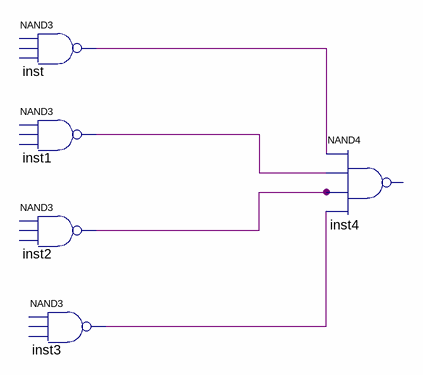
[diagram p0: schematic sheet]
// Quartus schematic lab3.bdf as structural Verilog: 5 symbols, 0 pins
module lab3 (
);

  wire inst1_out, inst2_out, inst3_out, inst_out;

  // NAND3 inst has open pins: IN1=open, IN2=open, IN3=open, OUT=inst_out
  // NAND3 inst1 has open pins: IN1=open, IN2=open, IN3=open, OUT=inst1_out
  // NAND3 inst2 has open pins: IN1=open, IN2=open, IN3=open, OUT=inst2_out
  // NAND3 inst3 has open pins: IN1=open, IN2=open, IN3=open, OUT=inst3_out
  // NAND4 inst4 has open pins: IN1=inst_out, IN2=inst1_out, IN3=inst2_out, IN4=inst3_out, OUT=open
endmodule
